# EAGLE design SMD_T (EAGLE 9.3.1)
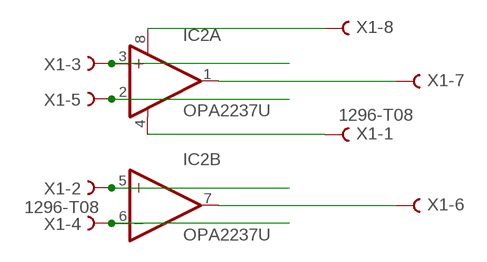
[diagram p0: schematic, sheet 1]

## Parts
IC2  OPA2237U  [SO08]
X1  1296-T08  [1296-08]

## Nets
N$1: IC2.3(A:+IN) X1.3
N$2: IC2.2(A:-IN) X1.5
N$3: IC2.8(A:V+) X1.8
N$4: IC2.4(A:V-) X1.1
N$5: IC2.5(B:+IN) X1.2
N$6: IC2.6(B:-IN) X1.4
N$7: IC2.7(B:OUT) X1.6
N$8: IC2.1(A:OUT) X1.7

## Library data of the parts
IC2 = burr-brown:OPA2237: Single-Supply Operational Amplifiers MicroAmplifier(TM) Series; Product Folder:OPA2237; MF: TEXAS INSTRUMENTS; MPN: OPA2237UA; OC_FARNELL: 1388075; OC_NEWARK: 80K6018
X1 = con-leotronics:1296-T08: 1.27mm SINGLE ROW FEMALE SOCKET Source: http://www.leotronics.co.uk/Conexcon/Data%20Sheets/sec.%20A/1296ing.pdf; OC_FARNELL: unknown; OC_NEWARK: unknown

## Board
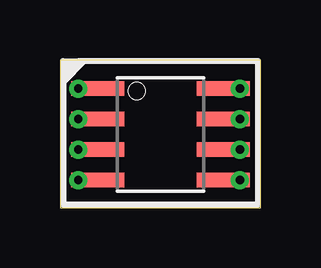
[diagram p1: board, top side]
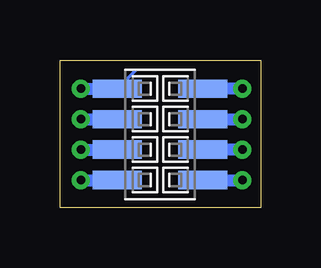
[diagram p2: board, bottom side, seen from below]

Size 8.36 x 6.15 mm. Coordinates in mm from the lower left corner, seen from the top.
Outline: 0,0 8.36,0 8.36,6.15 0,6.15 0,0
Copper layers (1*16): Top 0.035mm / dielectric 1.5mm / Bottom 0.035mm
Design rules "default *": minimum track width 6mil, minimum drill 0.35mm, track to track 6mil, track to pad 6mil, pad to pad 6mil, via to via 6mil, smd to smd 6mil, copper to edge 8mil, drill to drill 6mil, minimum pad ring 10mil, minimum via ring 8mil, stop-mask expansion 4mil, vias tented up to drill 0mil, thermal gap 10mil

### Footprints (pad centres in the part's own frame; a part is rotated, then mirrored left to right if it is on the bottom)
SO08 = smd 0.61 x 2.21: 1 -1.905,-2.616; 2 -0.635,-2.616; 3 0.635,-2.616; 4 1.905,-2.616; 5 1.905,2.616; 6 0.635,2.616; 7 -0.635,2.616; 8 -1.905,2.616
1296-08 = smd 0.76 x 2.05: 1 -1.905,-1.78; 2 -1.905,1.78; 3 -0.635,-1.78; 4 -0.635,1.78; 5 0.635,-1.78; 6 0.635,1.78; 7 1.905,-1.78; 8 1.905,1.78

### Placement (x,y rotation side)
IC2  4.19,3.05 270 top
X1  4.19,3.05 90 bottom

### Tracks (layer width: path | path; a pad name or v marks a point on that pad's centre or on a via)
N$1  (via drill 0.35)
  Top 0.508: IC2.3 v0.76,2.41
  Bottom 0.508: v0.76,2.41 X1.3
N$2  (via drill 0.35)
  Top 0.508: v0.76,3.68 IC2.2
  Bottom 0.508: X1.5 v0.76,3.68
N$3  (via drill 0.35)
  Top 0.508: IC2.8 v7.49,4.95
  Bottom 0.152: X1.8 5.22,5.7
  Bottom 0.508: v7.49,4.95 X1.8
N$4  (via drill 0.35)
  Top 0.508: v0.76,1.14 IC2.4
  Bottom 0.508: X1.1 v0.76,1.14
N$5  (via drill 0.35)
  Top 0.508: IC2.5 v7.49,1.14
  Bottom 0.508: v7.49,1.14 X1.2
N$6  (via drill 0.35)
  Top 0.508: IC2.6 v7.49,2.41
  Bottom 0.508: v7.49,2.41 X1.4
N$7  (via drill 0.35)
  Top 0.508: IC2.7 v7.49,3.68
  Bottom 0.508: v7.49,3.68 X1.6
N$8  (via drill 0.35)
  Top 0.254: IC2.1 1.4,4.95 1.27,5.08 1.14,4.95 v0.76,4.95
  Bottom 0.508: v0.76,4.95 X1.7